# EAGLE design LCmeter0-LCD-8pinlcd-PIC_COMP (EAGLE 7.2.0)
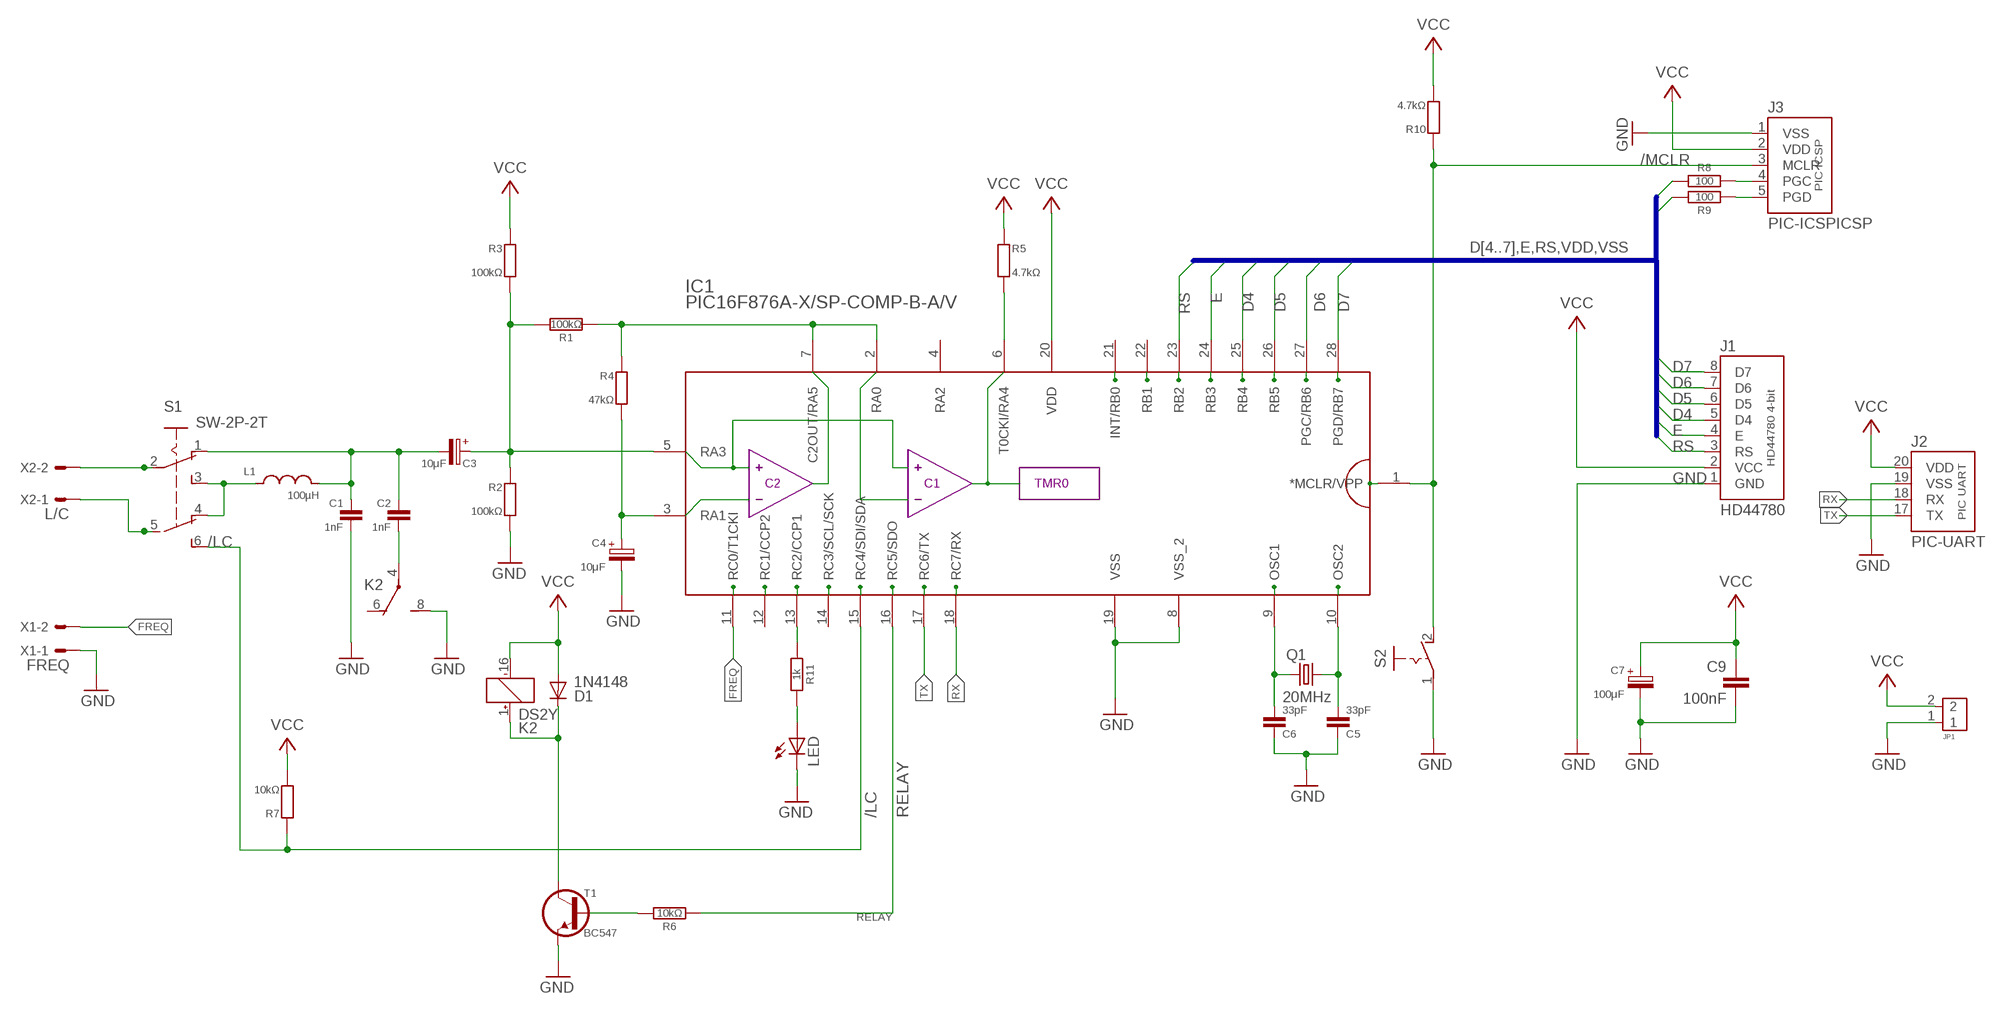
[diagram p0: schematic, sheet 1]

## Parts
C1  1nF  C050-020X036  [C050-020X036]
C2  1nF  C050-020X036  [C050-020X036]
C3  10μF  CPOL-HE2,5-4  [E2,5-4]
C4  10μF  CPOLE2,5-4  [E2,5-4]
C5  33pF  C025-020X036  [C025-020X036]
C6  33pF  C025-020X036  [C025-020X036]
C7  100μF  CPOLE2.5-5  [E2,5-5]
C9  100nF  C-EU025-024X044  [C025-024X044]
D1  1N4148  1N414834-7  [DO34-7]
IC1  PIC16F876A-X/SP-COMP-B-A/V  [DIL28-3/V]
J1  HD44780  HD44780-4BIT-8PIN  [CONN-8P]
J2  PIC-UART  [PIC-UART]
J3  PIC-ICSPICSP  [PIC-ICSP]
JP1  CONN-2P2P/V  [CONN-2P-V]
K2  DS2Y  DS2Y-S-DC5V  [DS2Y]
L1  100µH  L-SHORT02/5  [L-02/5V]
LED  TLLG4400  [LED3MM]
Q1  20MHz  CRYSTALHC49  [HC49]
R1  100kΩ  R-H0202/7  [0202/7]
R2  100kΩ  R0202/7  [0202/7]
R3  100kΩ  R0202/7  [0202/7]
R4  47kΩ  R0202/7  [0202/7]
R5  4.7kΩ  R0202/7  [0202/7]
R6  10kΩ  R-H0202/7  [0202/7]
R7  10kΩ  R0202/10  [0202/10]
R8  100  R-H0202/5  [0202/5]
R9  100  R-H0202/5  [0202/5]
R10  4.7kΩ  R0202/7  [0202/7]
R11  1k  R-H0202/5  [0202/5]
S1  SW-2P-2T  [SLSW-2P2T]
S2  PB-1P-1T  [PB-1P1T]
T1  BC547  BC547CBE-A  [TO92-CBE-A]
X1  FREQ  C-GRID-02-70543  [70543-02]
X2  L/C  C-GRID-02-70543  [70543-02]

## Nets
/LC: IC1.15(RC4/SDI/SDA) R7.1 S1.6(S1)
/MCLR: IC1.1(*MCLR/VPP) J3.3(MCLR) R10.1 S2.2(S)
/RELAY: D1.C K2.1(1:+) T1.C
A0: IC1.2(RA0) IC1.7(C2OUT/RA5) R1.1 R4.1
A1: C4.+ IC1.3(RA1) R4.2
A3: C3.+ IC1.5(RA3) R1.2 R2.1 R3.2
A4: IC1.6(T0CKI/RA4) R5.2
C2_CON: C2.2 K2.4(2:P)
D4: IC1.25(RB4) J1.5(D4)
D5: IC1.26(RB5) J1.6(D5)
D6: IC1.27(PGC/RB6) J1.7(D6) R9.1
D7: IC1.28(PGD/RB7) J1.8(D7) R8.1
E: IC1.24(RB3) J1.4(E)
FREQ: IC1.11(RC0/T1CKI) X1.2
GND: C1.2 C4.- C5.1 C6.1 C7.- C9.2 IC1.8(VSS_2) IC1.19(VSS) J1.1(GND) J2.19(VSS) J3.1(VSS) JP1.1 K2.8(2:S) LED.K(C) R2.2 S2.1(P) T1.E X1.1
M+: S1.2(P) X2.2
M-: S1.5(P1) X2.1
N$1: J3.4(PGC) R8.2
N$2: C1.1 C2.1 C3.- L1.2 S1.1(O)
N$3: J3.5(PGD) R9.2
N$4: IC1.13(RC2/CCP1) R11.2
N$5: R6.1 T1.B
N$6: LED.A R11.1
N$7: L1.1 S1.3(S) S1.4(O1)
OSC1: C6.2 IC1.9(OSC1) Q1.1
OSC2: C5.2 IC1.10(OSC2) Q1.2
RELAY: IC1.16(RC5/SDO) R6.2
RS: IC1.23(RB2) J1.3(RS)
RX: IC1.18(RC7/RX) J2.18(RX)
TX: IC1.17(RC6/TX) J2.17(TX)
VCC: C7.+ C9.1 D1.A IC1.20(VDD) J1.2(VCC) J2.20(VDD) J3.2(VDD) JP1.2 K2.16(1:-) R3.1 R5.1 R7.2 R10.2
Unconnected: IC1.4(RA2) IC1.12(RC1/CCP2) IC1.14(RC3/SCL/SCK) IC1.21(INT/RB0) IC1.22(RB1) K2.6(2:O) K2.9(3:S) K2.11(3:O) K2.13(3:P)

## Buses
D[4..7],E,RS,VDD,VSS

## Library data of the parts
C1 C2 C5 C6 = c:C: CAPACITOR, European symbol
C3 = c:CPOL-H
C4 C7 = c:CPOL: POLARIZED CAPACITOR, European symbol
C9 = rcl:C-EU: CAPACITOR, European symbol
D1 = d:1N4148
IC1 = mcu:PIC16F876A-X/SP-COMP-B-A
J1 = pinconn:HD44780-4BIT
J2 = pinconn:PIC-UART
J3 = pinconn:PIC-ICSP
JP1 = pinconn:CONN-2P
K2 = relay:DS2Y-S-DC*: MINIATURE RELAY NAiS Source: http://www.mew-europe.com/.. en_ds_61005_0023.pdf; MPN: DS2Y-S-DC5V; OC_FARNELL: unknown; OC_NEWARK: 13P3268
L1 = l:L-SHORT
LED = led:TLLG4400: Low Current (2mA) LED 3 mm Tinted Diffused Package color GREEN Source: Data sheet <http://www.farnell.com/datasheets/391098.pdf>; MF: VISHAY SEMICONDUCTOR; OC_FARNELL: 1612435
Q1 = q:CRYSTAL
R1 R6 R8 R9 R11 = r:R-H
R2-R5 R7 R10 = r:R: RESISTOR, European symbol
S1 = sw:SW-2P-2T
S2 = sw:PB-1P-1T
T1 = t:BC547
X1 X2 = con-molex:C-GRID-02: CONNECTOR wire to board 2.54 mm (0.100") pitch header; OC_FARNELL: unknown; OC_NEWARK: unknown

## Board
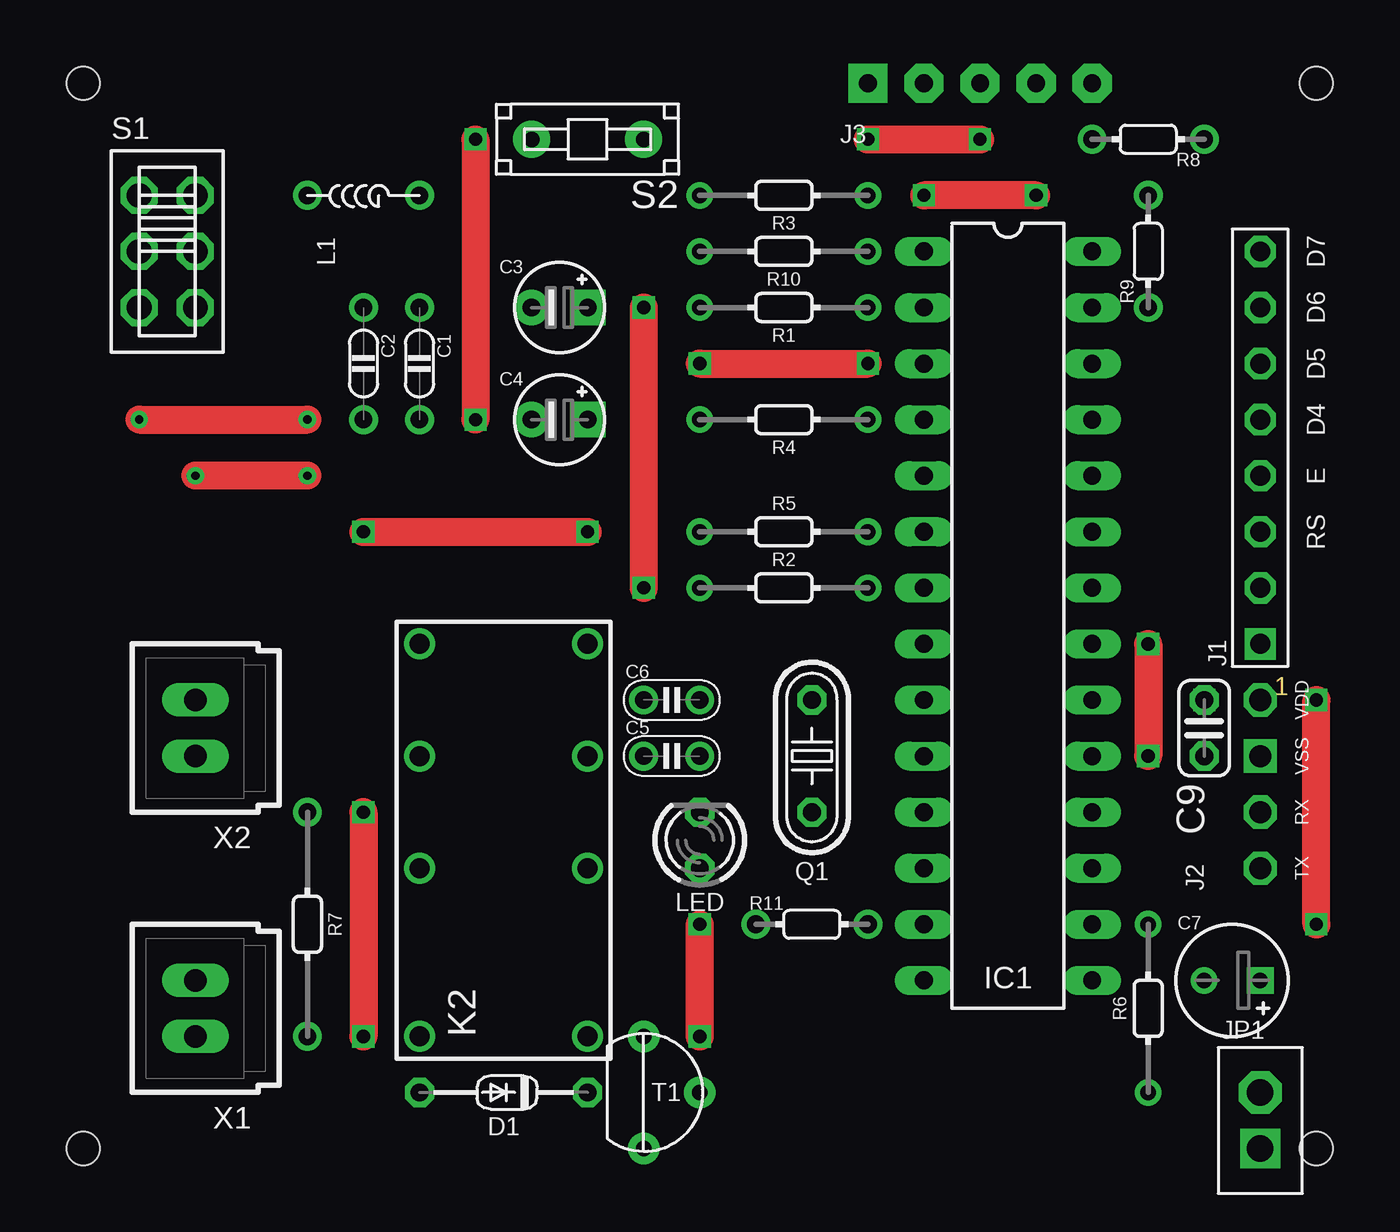
[diagram p1: board, top side]
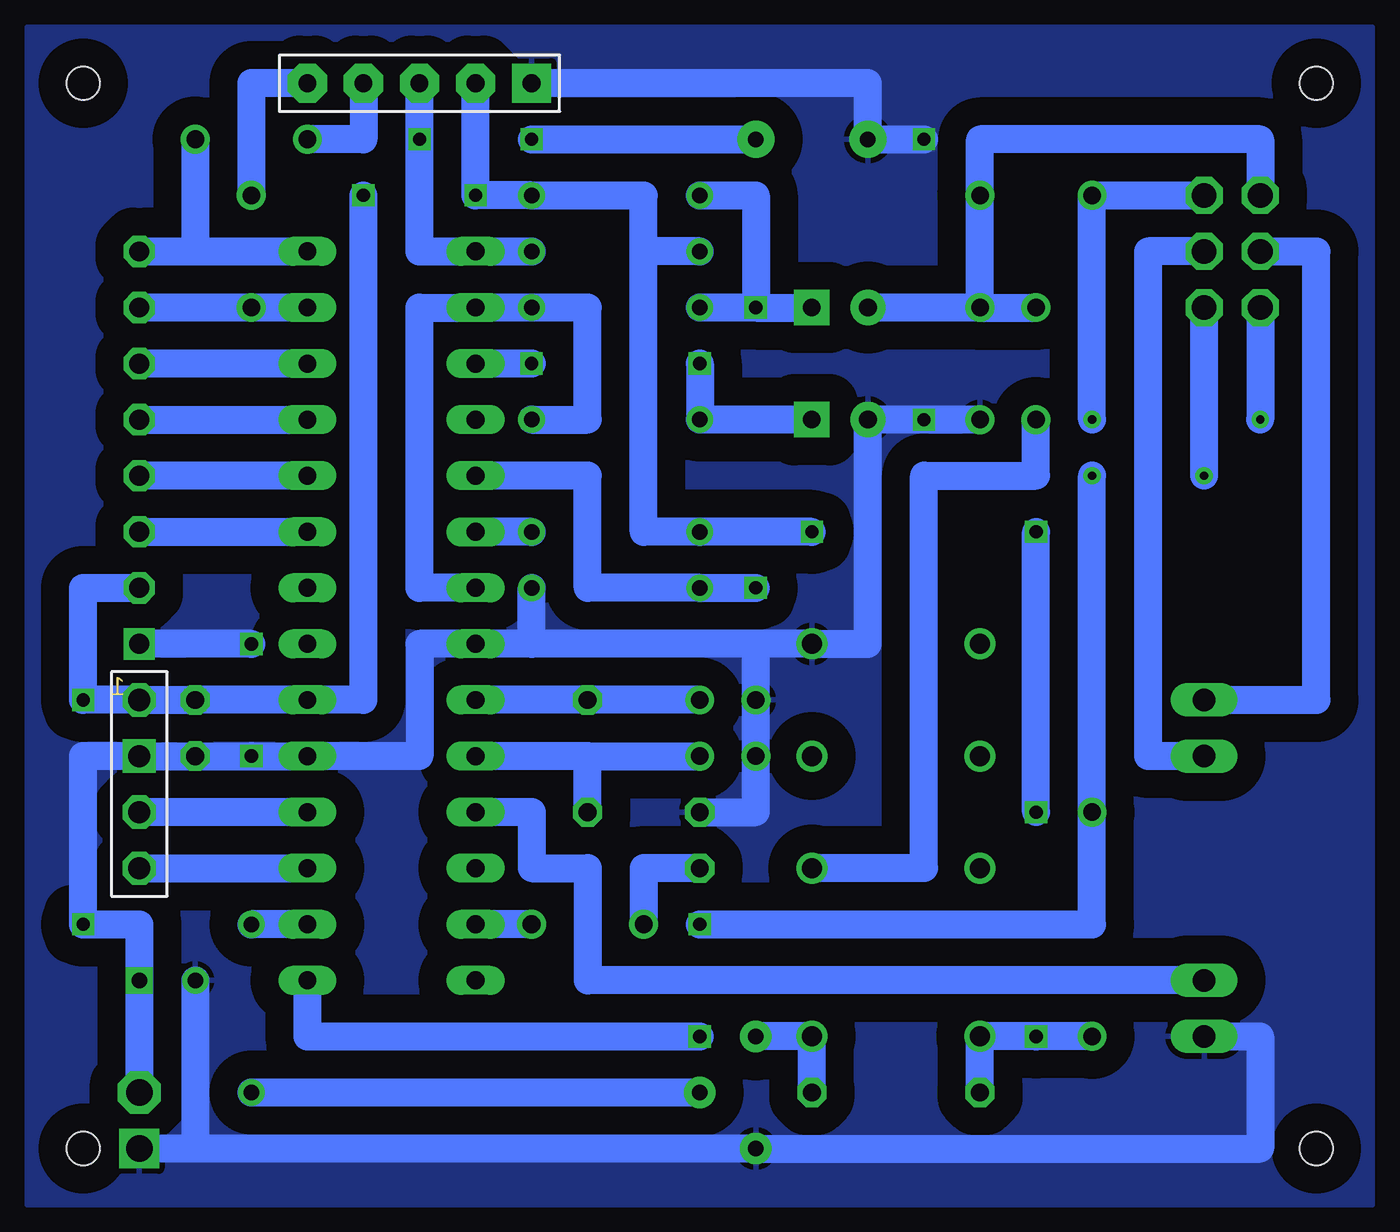
[diagram p2: board, bottom side, seen from below]

No outline drawn. Coordinates in mm, seen from the top.
Copper layers (1*16): Top 0.035mm / dielectric 1.5mm / Bottom 0.035mm
Design rules "default": minimum track width 10mil, minimum drill 24mil, track to track 8mil, track to pad 8mil, pad to pad 8mil, via to via 8mil, smd to smd 8mil, copper to edge 40mil, drill to drill 8mil, minimum pad ring 10mil, minimum via ring 8mil, stop-mask expansion 4mil, vias tented up to drill 0mil, thermal gap 10mil
Holes 1.5 mm at 0,48.26 55.88,48.26 55.88,0 0,0

### Footprints (pad centres in the part's own frame; a part is rotated, then mirrored left to right if it is on the bottom)
C050-020X036 = drill 0.8: 1 -2.54,0; 2 2.54,0
E2,5-4 = drill 0.8 pad 1.6 square: + 1.27,0 | drill 0.8 pad 1.6: - -1.27,0
C025-020X036 = drill 0.8: 1 0,0; 2 2.54,0
E2,5-5 = drill 0.7 square: + 1.27,0 | drill 0.7: - -1.27,0
C025-024X044 = drill 0.813 octagon: 1 -1.27,0; 2 1.27,0
DO34-7 = drill 0.813 octagon: A 3.81,0; C -3.81,0
DIL28-3/V = drill 0.813 long: 1 -3.81,16.51; 2 -3.81,13.97; 3 -3.81,11.43; 4 -3.81,8.89; 5 -3.81,6.35; 6 -3.81,3.81; 7 -3.81,1.27; 8 -3.81,-1.27; 9 -3.81,-3.81; 10 -3.81,-6.35; 11 -3.81,-8.89; 12 -3.81,-11.43; 13 -3.81,-13.97; 14 -3.81,-16.51; 15 3.81,-16.51; 16 3.81,-13.97; 17 3.81,-11.43; 18 3.81,-8.89; 19 3.81,-6.35; 20 3.81,-3.81; 21 3.81,-1.27; 22 3.81,1.27; 23 3.81,3.81; 24 3.81,6.35; 25 3.81,8.89; 26 3.81,11.43; 27 3.81,13.97; 28 3.81,16.51
CONN-8P = drill 0.9 pad 1.422 square: 1 0,0 | drill 0.9 pad 1.422 octagon: 2 2.54,0; 3 5.08,0; 4 7.62,0; 5 10.16,0; 6 12.7,0; 7 15.24,0; 8 17.78,0
PIC-UART = drill 1 octagon: 17 0,0; 18 0,2.54; 20 0,7.62 | drill 1 square: 19 0,5.08
PIC-ICSP = drill 0.8 pad 1.778 square: 1 -5.08,0 | drill 0.8 pad 1.778 octagon: 2 -2.54,0; 3 0,0; 4 2.54,0; 5 5.08,0
CONN-2P-V = drill 1.2 pad 1.778 square: 1 0,-1.27 | drill 1.2 pad 1.93 octagon: 2 0,1.27
DS2Y = drill 0.9: 1 -8.89,-3.81; 4 -1.27,-3.81; 6 3.81,-3.81; 8 8.89,-3.81; 9 8.89,3.81; 11 3.81,3.81; 13 -1.27,3.81; 16 -8.89,3.81
L-02/5V = drill 0.8: 1 0,2.54; 2 0,-2.54
LED3MM = drill 0.813 octagon: A -1.27,0; K 1.27,0
HC49 = drill 0.813 octagon: 1 0,-2.54; 2 0,2.54
0202/7 = drill 0.7: 1 -3.81,0; 2 3.81,0
0202/10 = drill 0.8: 1 -5.08,0; 2 5.08,0
0202/5 = drill 0.8: 1 -2.54,0; 2 2.54,0
SLSW-2P2T = drill 1.118 pad 1.524 octagon: 1 2.54,1.27; 2 0,1.27; 3 -2.54,1.27; 4 2.54,-1.27; 5 0,-1.27; 6 -2.54,-1.27
PB-1P1T = drill 0.7 pad 1.676: 1 2.54,0; 2 -2.54,0
TO92-CBE-A = drill 0.7 pad 1.422: B 2.54,0; C 0,2.54; E 0,-2.54
70543-02 = drill 1.016 long: 1 -1.27,0; 2 1.27,0

### Placement (x,y rotation side)
C1  15.24,35.56 270 top
C2  12.7,35.56 270 top
C3  21.59,38.1 0 top
C4  21.59,33.02 0 top
C5  25.4,17.78 0 top
C6  25.4,20.32 0 top
C7  52.07,7.62 0 top
C9  50.8,19.05 270 top
D1  19.05,2.54 180 top
IC1  41.91,24.13 0 top
J1  53.34,22.86 90 top
J2  53.34,12.7 0 top
J3  40.64,48.26 0 top
JP1  53.34,1.27 0 top
K2  19.05,13.97 90 top
L1  12.7,43.18 90 top
LED  27.94,13.97 90 top
Q1  33.02,17.78 180 top
R1  31.75,38.1 180 top
R2  31.75,25.4 0 top
R3  31.75,43.18 180 top
R4  31.75,33.02 180 top
R5  31.75,27.94 0 top
R6  48.26,6.35 90 top
R7  10.16,10.16 270 top
R8  48.26,45.72 180 top
R9  48.26,40.64 90 top
R10  31.75,40.64 180 top
R11  33.02,10.16 0 top
S1  3.81,40.64 90 top
S2  22.86,45.72 180 top
T1  25.4,2.54 0 top
X1  5.08,6.35 90 top
X2  5.08,19.05 90 top

### Tracks (layer width: path | path; a pad name or v marks a point on that pad's centre or on a via)
/LC  (via drill 0.38, 0.6)
  Top 1.27: v27.94,10.16 v27.94,5.08 | v10.16,30.48 v5.08,30.48
  Bottom 1.27: 32.85,5.08 v27.94,5.08 45.72,5.08 IC1.15 | v27.94,10.16 10.16,10.16 R7.1 v10.16,30.48 | v5.08,30.48 S1.6
/MCLR  (via drill 0.6)
  Top 1.27: v35.56,45.72 v40.64,45.72
  Bottom 1.27: J3.3 v40.64,45.72 40.64,40.64 IC1.1 R10.1 | v35.56,45.72 S2.2
/RELAY
  Bottom 1.27: T1.C K2.1 D1.C
A0
  Bottom 1.27: R4.1 33.02,33.02 33.02,38.1 R1.1 IC1.2 40.64,38.1 40.64,25.4 IC1.7
A1  (via drill 0.6)
  Top 1.27: v27.94,35.56 v35.56,35.56
  Bottom 1.27: C4.+ R4.2 v27.94,35.56 | v35.56,35.56 IC1.3
A3  (via drill 0.6)
  Top 1.27: v25.4,38.1 v25.4,25.4
  Bottom 1.27: R3.2 25.4,43.18 v25.4,38.1 | v25.4,38.1 R1.2 | v25.4,25.4 R2.1 33.02,25.4 33.02,30.48 IC1.5 | v25.4,38.1 C3.+
A4
  Bottom 1.27: R5.2 IC1.6
C2_CON
  Bottom 1.27: K2.4 17.78,12.7 17.78,30.48 12.7,30.48 C2.2
D4
  Bottom 1.27: J1.5 IC1.25
D5
  Bottom 1.27: IC1.26 J1.6
D6
  Bottom 1.27: J1.7 R9.1 IC1.27
D7
  Bottom 1.27: R8.1 50.8,40.64 | J1.8 50.8,40.64 | 50.8,40.64 IC1.28
E
  Bottom 1.27: IC1.24 J1.4
FREQ
  Bottom 1.27: X1.2 33.02,7.62 33.02,12.7 35.56,12.7 35.56,15.24 IC1.11
GND  (via drill 0.6)
  Top 1.27: v48.26,22.86 v48.26,17.78 | v17.78,45.72 v17.78,33.02
  Bottom 1.27: 25.4,22.86 C6.1 C5.1 25.4,15.24 LED.K | 25.4,22.86 35.56,22.86 | 35.56,22.86 R2.2 | X1.1 2.54,5.08 2.54,0 T1.E 50.8,0 | 55.88,10.16 55.88,17.78 J2.19 C9.2 v48.26,17.78 IC1.19 40.64,17.78 40.64,22.86 IC1.8 35.56,22.86 | 25.4,22.86 K2.8 20.32,22.86 C4.- v17.78,33.02 C1.2 | v48.26,22.86 J1.1 | J3.1 20.32,48.26 S2.1 v17.78,45.72 | 50.8,0 JP1.1 | C7.- 50.8,0
  pour Bottom (isolate 1.27): -2.54,50.8 -2.54,-2.54 58.42,-2.54 58.42,50.8
M+
  Bottom 1.27: X2.2 0,20.32 0,40.64 S1.2
M-
  Bottom 1.27: X2.1 7.62,17.78 7.62,40.64 S1.5
N$1
  Bottom 1.27: J3.4 43.18,45.72 R8.2
N$2
  Bottom 1.27: C1.1 C3.- | C1.1 C2.1 | S1.1 2.54,45.72 15.24,45.72 L1.2 C1.1
N$3
  Bottom 1.27: J3.5 48.26,48.26 R9.2
N$4
  Bottom 1.27: R11.2 IC1.13
N$5
  Bottom 1.27: R6.1 T1.B
N$6
  Bottom 1.27: LED.A 30.48,12.7 R11.1
N$7  (via drill 0.38)
  Top 1.27: v2.54,33.02 v10.16,33.02
  Bottom 1.27: S1.3 v2.54,33.02 | v10.16,33.02 L1.1 S1.4
OSC1
  Bottom 1.27: C6.2 Q1.1 IC1.9
OSC2
  Bottom 1.27: Q1.2 33.02,17.78 | 33.02,17.78 C5.2 | 33.02,17.78 IC1.10
RELAY
  Bottom 1.27: IC1.16 R6.2
RS
  Bottom 1.27: J1.3 IC1.23
RX
  Bottom 1.27: IC1.18 J2.18
TX
  Bottom 1.27: J2.17 IC1.17
VCC  (via drill 0.6)
  Top 1.27: v55.88,10.16 v55.88,20.32 | v12.7,15.24 v12.7,5.08 | v12.7,27.94 v22.86,27.94 | v43.18,43.18 v38.1,43.18
  Bottom 1.27: D1.A K2.16 v12.7,5.08 R7.2 | J1.2 55.88,25.4 v55.88,20.32 J2.20 C9.1 IC1.20 43.18,20.32 v43.18,43.18 | 30.48,40.64 30.48,27.94 R5.1 v22.86,27.94 | 30.48,40.64 30.48,43.18 R3.1 v38.1,43.18 J3.2 | v12.7,15.24 v12.7,27.94 | R10.2 30.48,40.64 | v55.88,10.16 53.34,10.16 C7.+ JP1.2
  other vias: 50.8,20.32

### Text on the board
tPlace: D7 | D6 | D5 | D4 | E | RS
Measures: 20 | 19 | 18 | 17 | 16 | 15 | 14 | 13 | 12 | 11 | 10 | 9 | 8 | 7 | 6 | 5 | 4 | 3 | 2 | 1 | 1 | 2 | 3 | 4 | 5 | 6 | 7 | 8 | 9 | 10 | 11 | 12 | 13 | 14 | 15 | 16 | 17 | 18 | 19 | 20 | 21 | 22 | 23